# EAGLE design Adafruit ESP32 Feather V2 (EAGLE 9.6.2)
COMPANY: ADAFRUIT INDUSTRIES; DRAWN: ladyada; REV: E
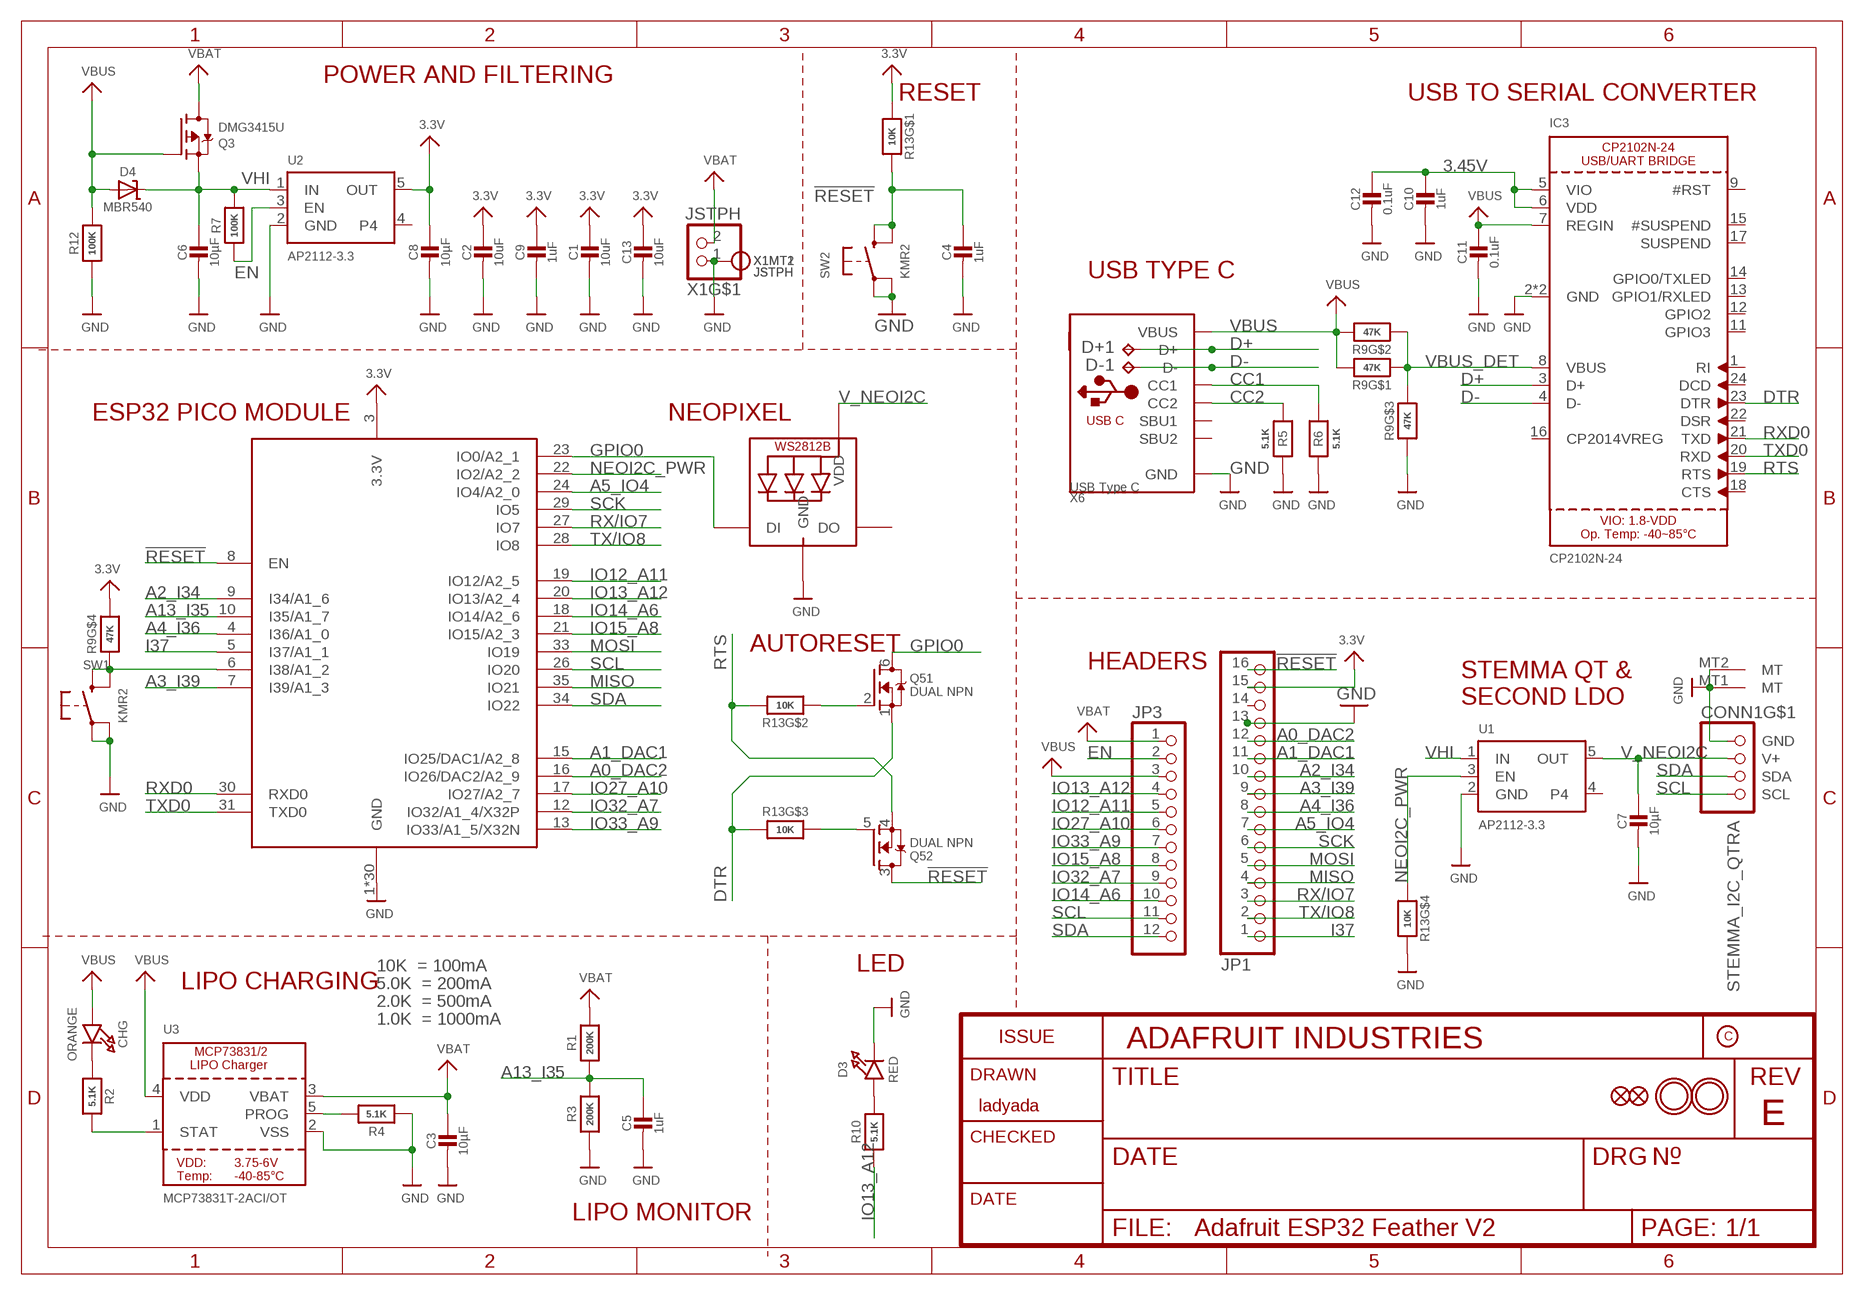
[diagram p0: schematic, sheet 1]

## Parts
C1  10uF  CAP_CERAMIC0805-NOOUTLINE  [0805-NO]
C2  10uF  CAP_CERAMIC0805-NOOUTLINE  [0805-NO]
C3  10µF  CAP_CERAMIC0805-NOOUTLINE  [0805-NO]
C4  1uF  CAP_CERAMIC0603_NO  [0603-NO]
C5  1uF  CAP_CERAMIC0603_NO  [0603-NO]
C6  10µF  CAP_CERAMIC0805-NOOUTLINE  [0805-NO]
C7  10µF  CAP_CERAMIC0805-NOOUTLINE  [0805-NO]
C8  10µF  CAP_CERAMIC0805-NOOUTLINE  [0805-NO]
C9  1uF  CAP_CERAMIC0603_NO  [0603-NO]
C10  1uF  CAP_CERAMIC0603_NO  [0603-NO]
C11  0.1uF  CAP_CERAMIC0603_NO  [0603-NO]
C12  0.1uF  CAP_CERAMIC0603_NO  [0603-NO]
C13  10uF  CAP_CERAMIC0805-NOOUTLINE  [0805-NO]
CHG  ORANGE  LED0603_NOOUTLINE  [CHIPLED_0603_NOOUTLINE]
CONN1  STEMMA_I2C_QTRA  [JST_SH4_RA]
D3  RED  LED0603_NOOUTLINE  [CHIPLED_0603_NOOUTLINE]
D4  MBR540  DIODE-SCHOTTKYSOD-123  [SOD-123]
D+1  TPB1,27  [B1,27]
D-1  TPB1,27  [B1,27]
IC3  CP2102N-24  [QFN24_4MM_SMSC]
JP1  HEADER-1X16ROUND  [1X16_ROUND]
JP3  HEADER-1X12  [1X12_ROUND]
LED1  WS2812B3535  [LED3535]
Q3  DMG3415U  MOSFET-P  [SOT23-R]
Q5  DUAL NPN  MOSFET-N_DUAL  [SOT363]
R1  200K  RESISTOR_0603_NOOUT  [0603-NO]
R2  5.1K  RESISTOR_0603_NOOUT  [0603-NO]
R3  200K  RESISTOR_0603_NOOUT  [0603-NO]
R4  5.1K  RESISTOR_0603_NOOUT  [0603-NO]
R5  5.1K  RESISTOR_0603_NOOUT  [0603-NO]
R6  5.1K  RESISTOR_0603_NOOUT  [0603-NO]
R7  100K  RESISTOR_0603_NOOUT  [0603-NO]
R9  47K  RESISTOR_4PACK  [RESPACK_4X0603]
R10  5.1K  RESISTOR_0603_NOOUT  [0603-NO]
R12  100K  RESISTOR_0603_NOOUT  [0603-NO]
R13  10K  RESISTOR_4PACK  [RESPACK_4X0603]
SW1  KMR2  SWITCH_TACT_SMT4.6X2.8  [BTN_KMR2_4.6X2.8]
SW2  KMR2  SWITCH_TACT_SMT4.6X2.8  [BTN_KMR2_4.6X2.8]
U1  AP2112-3.3  VREG_SOT23-5  [SOT23-5]
U2  AP2112-3.3  VREG_SOT23-5  [SOT23-5]
U3  MCP73831T-2ACI/OT  MCP73831/2  [SOT23-5]
U$31  MOUNTINGHOLE2.5  [MOUNTINGHOLE_2.5_PLATED]
U$32  MOUNTINGHOLE2.5  [MOUNTINGHOLE_2.5_PLATED]
U$34  FIDUCIAL_1MM  [FIDUCIAL_1MM]
U$35  FIDUCIAL_1MM  [FIDUCIAL_1MM]
X1  JSTPH  CON_JST_PH_2PIN_MT_BATT  [JSTPH2_BATT]
X3  ESP32-PICO-MINI-02MINI  [ESP32-PICO-MINI]
X6  USB Type C  USB_C  [USB_C_CUSB31-CFM2AX-01-X]

## Nets
3.3V [power]: C1.1 C2.1 C8.1 C9.1 C13.1 JP1.15 R9.5 R13.1 U2.5(OUT) X3.3(3.3V)
3.45V [power]: C10.1 C12.1 IC3.5(VIO) IC3.6(VDD)
!RESET: C4.1 JP1.16 Q5.3(2:D) R13.8 SW2.B'(S1) SW2.B(S) X3.8(EN)
A0_DAC2: JP1.12 X3.16(IO26/DAC2/A2_9)
A1_DAC1: JP1.11 X3.15(IO25/DAC1/A2_8)
A2_I34: JP1.10 X3.9(I34/A1_6)
A3_I39: JP1.9 X3.7(I39/A1_3)
A4_I36: JP1.8 X3.4(I36/A1_0)
A5_IO4: JP1.7 X3.24(IO4/A2_0)
A13_I35: C5.1 R1.1 R3.2 X3.10(I35/A1_7)
CC1: R6.2 X6.A5(CC1)
CC2: R5.2 X6.B5(CC2)
D+: D+1.TP IC3.3(D+) X6.A6(D+) X6.B6(D+)
D-: D-1.TP IC3.4(D-) X6.A7(D-) X6.B7(D-)
DTR: IC3.23(DTR) Q5.1(1:S) R13.3
EN: JP3.2 R7.1 U2.3(EN)
GND [power]: C1.2 C2.2 C3.2 C4.2 C5.2 C6.2 C7.2 C8.2 C9.2 C10.2 C11.2 C12.2 C13.2 CONN1.1(GND) CONN1.MT1(MT) CONN1.MT2(MT) D3.C IC3.2(GND) IC3.THERM(GND) JP1.13 LED1.4(GND) R3.1 R4.1 R5.1 R6.1 R9.3 R12.1 R13.5 SW1.A'(P1) SW1.A(P) SW2.A'(P1) SW2.A(P) U1.2(GND) U2.2(GND) U3.2(VSS) X1.1 X1.NC1 X1.NC2 X3.1(GND) X3.2(GND) X3.11(GND) X3.14(GND) X3.36(GND) X3.37(GND) X3.38(GND) X3.39(GND) X3.40(GND) X3.41(GND) X3.42(GND) X3.43(GND) X3.44(GND) X3.45(GND) X3.46(GND) X3.47(GND) X3.48(GND) X3.49(GND) X3.50(GND) X3.51(GND) X3.52(GND) X3.53(GND) X3.54(GND) X3.55(GND) X3.56(GND) X3.57(GND) X3.58(GND) X3.59(GND) X3.60(GND) X3.61(GND) X6.A1B12(GND) X6.B1A12(GND)
GPIO0: LED1.1(DI) Q5.6(1:D) X3.23(IO0/A2_1)
I37: JP1.1 X3.5(I37/A1_1)
IO12_A11: JP3.5 X3.19(IO12/A2_5)
IO13_A12: JP3.4 R10.1 X3.20(IO13/A2_4)
IO14_A6: JP3.10 X3.18(IO14/A2_6)
IO15_A8: JP3.8 X3.21(IO15/A2_3)
IO27_A10: JP3.6 X3.17(IO27/A2_7)
IO32_A7: JP3.9 X3.12(IO32/A1_4/X32P)
IO33_A9: JP3.7 X3.13(IO33/A1_5/X32N)
MISO: JP1.4 X3.35(IO21)
MOSI: JP1.5 X3.33(IO19)
N$1: CHG.C R2.1
N$3: R2.2 U3.1(STAT)
N$4: R4.2 U3.5(PROG)
N$5: D3.A R10.2
N$6: R9.4 SW1.B'(S1) SW1.B(S) X3.6(I38/A1_2)
N$12: Q5.5(2:G) R13.6
N$13: Q5.2(1:G) R13.2
NEOI2C_PWR: R13.4 U1.3(EN) X3.22(IO2/A2_2)
RTS: IC3.19(RTS) Q5.4(2:S) R13.7
RX/IO7: JP1.3 X3.27(IO7)
RXD0: IC3.21(TXD) X3.30(RXD0)
SCK: JP1.6 X3.29(IO5)
SCL: CONN1.4(SCL) JP3.11 X3.26(IO20)
SDA: CONN1.3(SDA) JP3.12 X3.34(IO22)
TX/IO8: JP1.2 X3.28(IO8)
TXD0: IC3.20(RXD) X3.31(TXD0)
V_NEOI2C [power]: C7.1 CONN1.2(V+) LED1.2(VDD) U1.5(OUT)
VBAT [power]: C3.1 JP3.1 Q3.3(D) R1.2 U3.3(VBAT) X1.2
VBUS [power]: C11.1 CHG.A D4.A IC3.7(REGIN) JP3.3 Q3.1(G) R9.7 R9.8 R12.2 U3.4(VDD) X6.A4B9(VBUS) X6.B4A9(VBUS)
VBUS_DET: IC3.8(VBUS) R9.1 R9.2 R9.6
VHI [power]: C6.1 D4.C Q3.2(S) R7.2 U1.1(IN) U2.1(IN)
Unconnected: IC3.1(RI) IC3.9(#RST) IC3.11(GPIO3) IC3.12(GPIO2) IC3.13(GPIO1/RXLED) IC3.14(GPIO0/TXLED) IC3.15(#SUSPEND) IC3.16(CP2014VREG) IC3.17(SUSPEND) IC3.18(CTS) IC3.22(DSR) IC3.24(DCD) JP1.14 LED1.3(DO) U1.4 U2.4 X6.A8(SBU1) X6.B8(SBU2)

## Notes on the sheet
- POWER AND FILTERING | RESET
- USB TO SERIAL CONVERTER
- USB TYPE C
- ESP32 PICO MODULE | NEOPIXEL
- AUTORESET
- HEADERS
- STEMMA QT &
  SECOND LDO
- 10K  = 100mA | LED
- LIPO CHARGING | 5.0K  = 200mA
- 2.0K  = 500mA
- 1.0K  = 1000mA
- LIPO MONITOR

## Library data of the parts
C1-C7 C9-C13 = microbuilder:CAP_CERAMIC: Ceramic Capacitors For new designs, use the packages preceded by an '_' character since they are more reliable: The following footprints should be used on most boards: _0402 - Standard footprint for regular board layouts _0603 - Standard footprint for regular board layouts _0805 - Standard footprint for regular board layouts _1206 - Standard footprint for regular board layouts For extremely tight-pitch boards where space is at a premium, the following 'micro-pitch' footprints can be used (smaller pads, no silkscreen outline, etc.): _0402MP - Micro-pitch footprint for very dense/compact boards _0603MP - Micro-pitch footprint for very dense/compact boards _0805MP - Micro-pitch footprint for very dense/compact boards _1206MP - Micro-pitch footprint for very dense/compact boards
C8 = microbuilder:CAP_CERAMIC: Ceramic Capacitors For new designs, use the packages preceded by an '_' character since they are more reliable: The following footprints should be used on most boards: _0402 - Standard footprint for regular board layouts _0603 - Standard footprint for regular board layouts _0805 - Standard footprint for regular board layouts _1206 - Standard footprint for regular board layouts For extremely tight-pitch boards where space is at a premium, the following 'micro-pitch' footprints can be used (smaller pads, no silkscreen outline, etc.): _0402MP - Micro-pitch footprint for very dense/compact boards _0603MP - Micro-pitch footprint for very dense/compact boards _0805MP - Micro-pitch footprint for very dense/compact boards _1206MP - Micro-pitch footprint for very dense/compact boards; REV: F
CHG D3 = microbuilder:LED: LED 0603 - 0603 Surface Mount Package 2mA: Green LED - Low Power (3.9mcd, 2ma, 1.7Vf) - Digikey: 475-2709-2-ND Orange LED - Low Power (9.8mcd, 2ma, 1.8Vf) - Digikey: 475-1194-2-ND Red LED - Low Power (5mcd, 2ma, 1.8Vf) - Digikey: 475-1195-2-ND Yellow LED - Low Power (7mcd, 2ma, 1.8Vf) - Digikey: 475-1196-2-ND 5mA: Blue LED - Low Power (17mcd, 5ma, 2.9Vf) - Digikey: LNJ937W8CRACT-ND 0805 - 0805 Surface Mount Package 2mA: Red LED (8.8mcd, 2mA, 1.8Vf, Clear) - Low Power [Digikey: 475-2510-1-ND] Green LED (5mcd, 2mA, 1.8Vf, Clear) - Low Power [Digikey: 475-2730-1-ND] Yellow LED (11.3mcd, 2mA, 1.8Vf, Clear) - Low Power [Digikey: 475-2555-1-ND] 20mA: Red LED (104mcd, 20mA, Diffused) - LS R976 [Digikey: 475-1278-6-ND] Red LED (12mcd, 20mA, 2.0Vf, Clear) - APT2012EC [Digikey: 754-1128-1-ND] Green LED (15mcd, 20mA, 2.2Vf, Clear) - APT2012GC [Digikey: 754-1131-1-ND] Orange LED (160mcd, 20mA, 2.1Vf, Clear) - APT2012SECK [Digikey: 754-1130-1-ND] 1206 - 1206 Surface Mount Package Green LED (26mcd, 20mA, Diffused) - LG N971 [Digikey: 475-1407-6-ND] Red LED (15mcd, 20mA, Diffused) - LH N974 [Digikey: 475-1416-6-ND] Cree - Cree High-Power Surface Mount LEDs XPEBWT-L1-0000-00D50 - White 111lm 350mA 2.9Vf 6200K 110° XTEAWT-00-0000-00000LEE3 - White 114lm 350mA 2.85Vf 5000K 115° Everlight - Everlight 45-21 Series Surface Mount LEDs 45-21/QK2C-B2832AC2CB2/2T - Warm White 2000mcd 20mA 3.25Vf 3050K 120° 45-21/LK2C-B38452C4CB2/2T - Nuetral White 2000mcd 20mA 3.25Vf 4150K 120° 45-21/LK2C-B50634C6CB2/2T - Cold White 2200mcd 20mA 3.25Vf 5650K 120° PLCC2 Reverse Mount LS T77K-J1L2-1-0-2-R18-Z - Red 11.25mcd 2mA 1.8Vf 630nm 120° LO T77K-L1M2-24-Z - Orange 19.6mcd 2mA 1.8Vf 606nm 120° LY T77K-K2M1-26-Z - Yellow 15.7mcd 2mA 1.8Vf 587nm 120°
CONN1 = microbuilder:STEMMA_I2C
D4 = microbuilder:DIODE-SCHOTTKY
D+1 D-1 = testpad:TP: Test pad
IC3 = microbuilder:CP2102N-24
JP1 = microbuilder:HEADER-1X16: PIN HEADER
JP3 = microbuilder:HEADER-1X12
LED1 = microbuilder:WS2812B
Q3 = microbuilder:MOSFET-P: P-Channel Mosfet LEGEND VDS: Voltage Drain-Source ID: Drain Current RDS(ON): Drain-Source On-State Resistance VGS(TH): Gate-Source Threshold Voltage CISS: Drain-Source Input Capacitance SOT-23 Name VDS ID RDS(ON) VGS(TH) CISS Order Number IRLML5103 30V 760mA 600 mOhm -- 75pF @ 25V Digikey: IRLML5103PBFCT-ND IRLML6401 12V 4.3A 50 mOhm 950mV @ 250µA 830pF @ 10V Digikey: IRLML6401PBFTR-ND NTR0202PL 20V 400mA 800 mOhm 2.3V @ 250uA 70pF @ 5V Digikey: NTR0202PLT1GOSTR-ND NTR4101PT1G 20V 1.8A 85 mOhm 1.2V @ 250uA 675pF @ 10V Digikey: NTR4101PT1GOSCT-ND DMP2004K 20V 600mA 900 mOhm 1V @ 250uA 175pF @ 16V Digikey: DMP2004KDICT-ND PMV65XP 20V 3.9A 76 mOhm 950mV @ 1mA 725pF @ 20V Digikey: 568-2358-2-ND TO-252 Name VDS ID RDS(ON) VGS(TH) CISS Order Number AOD417 30V 25A 34 mOhm 3V @ 250µA 920pF @ 15V Digikey: 785-1106-2-ND PowerPak Name VDS ID RDS(ON) VGS(TH) CISS Order Number AON7401 30V 12A 14 mOhm 3V @ 250µA 2600pF @ 15V Digikey: 785-1302-1-ND
Q5 = microbuilder:MOSFET-N_DUAL: Dual N-Channel MOSFET SOT363 (2.0x1.25mm) 2N7002PS - 60V, 320mA [Digikey: 568-5984-1-ND]
R1-R7 R10 R12 = microbuilder:RESISTOR: Resistors For new designs, use the packages preceded by an '_' character since they are more reliable: The following footprints should be used on most boards: _0402 - Standard footprint for regular board layouts _0603 - Standard footprint for regular board layouts _0805 - Standard footprint for regular board layouts _1206 - Standard footprint for regular board layouts For extremely tight-pitch boards where space is at a premium, the following 'micro-pitch' footprints can be used (smaller pads, no silkscreen outline, etc.): _0402MP - Micro-pitch footprint for very dense/compact boards _0603MP - Micro-pitch footprint for very dense/compact boards _0805MP - Micro-pitch footprint for very dense/compact boards _1206MP - Micro-pitch footprint for very dense/compact boards
R9 R13 = microbuilder:RESISTOR_4PACK: Resistor Packs (4 resistors) 4 x 0603 10K 1/16W - Digikey: YC164J-10KCT-ND
SW1 SW2 = adafruit_electromech:SWITCH_TACT_SMT: SMT Tact Switches 6x6mm - Digikey: P12940SCT-ND KMR2 (4.6x2.8mm) - Digikey: 401-1426-1-ND EVQ-PQHB55 - Light Touch, 160GF (4.5x4.5mm) - Digikey: P8090SCT-ND KMT0 - KMT021 NGJ LHS (etc.) IP68/Waterproof - Digikey: CKN10289CT-ND
U1 U2 = adafruit_power:VREG_SOT23-5: SOT23-5 Fixed Voltage Regulators Part Current Out V Out V In V Dropout θJA (°C/W) TJ (°C) Digikey Part No. ADP121 150mA 3.3V 3.4-5.5V 0.09V @ 150mA -- -- ADP121-AUJZ33R7CT-ND ADP121 150mA 3.0V 3.1-5.5V 0.09V @ 150mA -- -- ADP121-AUJZ30R7CT-ND ADP122 300mA 3.3V 3.4-5.5V 0.085V @ 300mA -- -- ADP122AUJZ-3.3-R7CT-ND ADP1712 300mA 3.3V 3.5-5.5V 0.17V @ 300mA -- -- ADP1712AUJZ-3.3-R7TR-ND AP7311 (Low Cost) 150mA 3.3V 3.5-6V 0.15V @ 150mA -- -- AP7311-33WG-7DICT-ND LD39015M18R 150mA 1.8V 1.9V-5.5V 0.08V @ 100mA -- -- 497-6977-1-ND LP2985A-33DBVR 150mA 3.3V 3.3-16V 0.28V @ 150mA 206 150 296-18479-1-ND MCP1824T-3302E/OT 300mA 3.3V 3.5V-6V 0.2V @ 300mA -- -- MCP1824T-3302E/OTCT-ND MIC5205-2.5YM5 TR 150mA 2.5V 2.7-16V 0.165V @ 150mA -- -- 576-1257-2-ND MIC5205-3.0YM5 TR 150mA 3.0V 3.2V-16V 0.165V @ 150mA -- -- 576-1258-2-ND MIC5205-3.3YM5 TR 150mA 3.3V 3.5V-16V 0.165V @ 150mA -- -- 576-1259-2-ND TPS780330220 150mA 3.3V+2.2V 3.6-5.5V 250mV Max -- -- 296-23332-1-ND TDA3663/N1,135 100mA 3.3V 3.5-45V 0.18V @ 50mA -- -- 568-5343-1-ND Max operating temp can be calculated using θJA, TJ (max junction temperature), and power in watts. Set the "Maximum Ambient Temperature" until it reaches TJ ("Max Junction Temperature"), which is the absolute limit for safe use of the regulator: Heat Sink Temperature Calculator <http://www.daycounter.com/Calculators/Heat-Sink-Temperature-Calculator.phtml> For example, With 12V source into a 3.3V LP2985 and a 30mA load, we are dissipating (12V-3.3V) * 0.03A = 0.261W. With a θJA of 206 °C/W, a TJ of 150°C, and 261mW we can safely use the chip without a heat sink up to 75°C (=147.1°C Junction Temperature).
U3 = microbuilder:MCP73831/2: MCP73831/2 LIPO Charger VDD: 3.75 - 6V Temp -40 - 85°C Programmable Charge Rate: 15-500mA NOTE: STAT is a tri-state logic output on the MCP73831 and an open-drain output on the MCP73832. SOT23-5 with 4.2V output and tri-state logic on STAT = MCP73831T-2ACI/OT
U$31 U$32 = adafruit_electromech:MOUNTINGHOLE: Mounting Hole For #2 screws (0.086"/2.18mm width, 0.094"/2.4mm hole) use 2.5mm; BOM: EXCLUDE
U$34 U$35 = microbuilder:FIDUCIAL: Fiducial Alignment Points Various fiducial points for machine vision alignment.; BOM: EXCLUDE
X1 = adafruit_electromech:CON_JST_PH_2PIN_MT
X3 = adafruit_wireless:ESP32-PICO-MINI-02
X6 = adafruit_electromech:USB_C: USB Type-C USB 2.0 Connector

## Net classes
1 power: width 0.305 mm

## Board
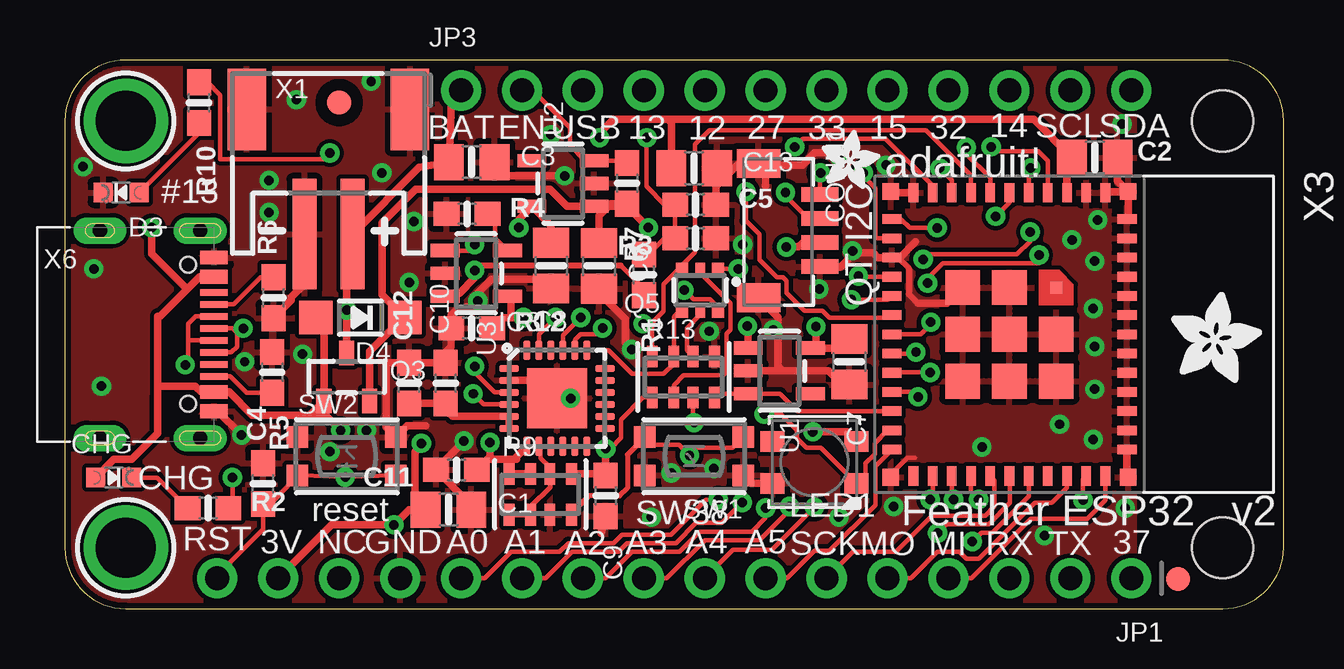
[diagram p1: board, top side]
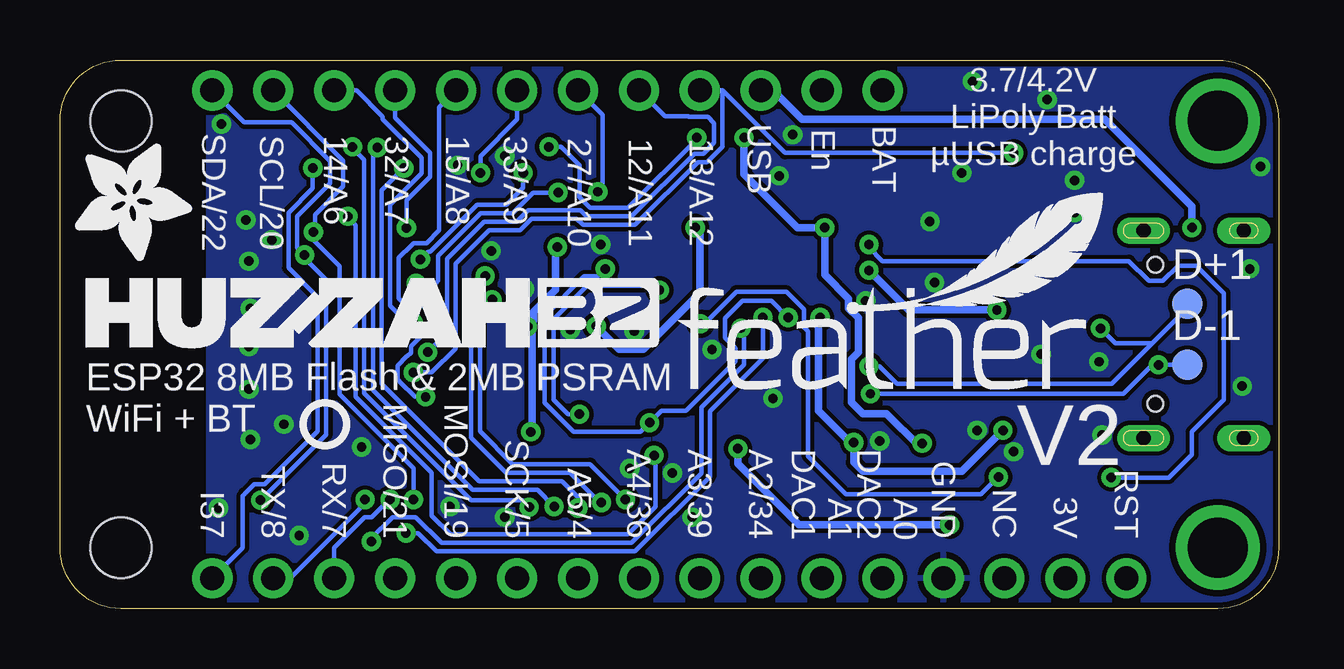
[diagram p2: board, bottom side, seen from below]

Size 50.8 x 22.86 mm. Coordinates in mm from the lower left corner, seen from the top.
Outline: 2.54,0 48.26,0 arc90 50.8,2.54 50.8,20.32 arc90 48.26,22.86 2.54,22.86 arc90 0,20.32 0,2.54 arc90 2.54,0
Copper layers (1*16): Top 0.035mm / dielectric 1.5mm / Bottom 0.035mm
Design rules "adafruit 7-7": minimum track width 7mil, minimum drill 15.5mil, track to track 7mil, track to pad 7mil, pad to pad 7mil, via to via 7mil, smd to smd 7mil, copper to edge 10mil, drill to drill 8mil, minimum pad ring 10mil, minimum via ring 8mil, stop-mask expansion 2mil, vias tented up to drill 20mil, thermal gap 10mil
Holes 2.54 mm at 48.26,2.54 48.26,20.32

### Footprints (pad centres in the part's own frame; a part is rotated, then mirrored left to right if it is on the bottom)
0805-NO = smd 1.24 x 1.5: 1 -0.95,0; 2 0.95,0
0603-NO = smd 1.075 x 1: 1 -0.85,0; 2 0.85,0
CHIPLED_0603_NOOUTLINE = smd 0.8 x 0.8: A 0,-0.75; C 0,0.75
JST_SH4_RA = smd 0.6 x 1.55: 1 1.5,1.686; 2 0.5,1.686; 3 -0.5,1.686; 4 -1.5,1.686 | smd 1.2 x 1.8: MT1 -2.8,-0.862; MT2 2.8,-0.862
SOD-123 = smd 1.4 x 1.4: A 1.85,0; C -1.85,0
B1,27 = smd 1.27 x 1.27: TP 0,0
QFN24_4MM_SMSC = smd 0.8 x 0.28: 1 -2,1.25; 2 -2,0.75; 3 -2,0.25; 4 -2,-0.25; 5 -2,-0.75; 6 -2,-1.25; 13 2,-1.25; 14 2,-0.75; 15 2,-0.25; 16 2,0.25; 17 2,0.75; 18 2,1.25 | smd 0.28 x 0.8: 7 -1.25,-2; 8 -0.75,-2; 9 -0.25,-2; 10 0.25,-2; 11 0.75,-2; 12 1.25,-2; 19 1.25,2; 20 0.75,2; 21 0.25,2; 22 -0.25,2; 23 -0.75,2; 24 -1.25,2 | smd 2.5 x 2.5: THERM 0,0
1X16_ROUND = drill 1 pad 1.676: 1 -19.05,0; 2 -16.51,0; 3 -13.97,0; 4 -11.43,0; 5 -8.89,0; 6 -6.35,0; 7 -3.81,0; 8 -1.27,0; 9 1.27,0; 10 3.81,0; 11 6.35,0; 12 8.89,0; 13 11.43,0; 14 13.97,0; 15 16.51,0; 16 19.05,0
1X12_ROUND = drill 1 pad 1.676: 1 -13.97,0; 2 -11.43,0; 3 -8.89,0; 4 -6.35,0; 5 -3.81,0; 6 -1.27,0; 7 1.27,0; 8 3.81,0; 9 6.35,0; 10 8.89,0; 11 11.43,0; 12 13.97,0
LED3535 = smd 1 x 0.85: 1 -1.75,0.875; 2 -1.75,-0.875; 3 1.75,-0.875; 4 1.75,0.875
SOT23-R = smd 0.635 x 1.016: 1 -0.95,-1; 2 0.95,-1; 3 0,1
SOT363 = smd 0.5 x 0.5: 1 -0.75,-0.9; 3 0.75,-0.9; 4 0.75,0.9; 6 -0.75,0.9 | smd 0.4 x 0.5: 2 0,-0.9; 5 0,0.9
RESPACK_4X0603 = smd 0.45 x 0.9: 1 -1.3,-0.85; 2 -0.4,-0.85; 3 0.4,-0.85; 4 1.3,-0.85; 5 1.3,0.85; 6 0.4,0.85; 7 -0.4,0.85; 8 -1.3,0.85
BTN_KMR2_4.6X2.8 = smd 0.9 x 0.9: A 2.05,0.8; A' -2.05,0.8; B 2.05,-0.8; B' -2.05,-0.8
SOT23-5 = smd 0.55 x 1.2: 1 -0.95,-1.3; 2 0,-1.3; 3 0.95,-1.3; 4 0.95,1.3; 5 -0.95,1.3
MOUNTINGHOLE_2.5_PLATED = drill 2.5 pad 3.2: P$1 0,0
FIDUCIAL_1MM = smd 1 x 1: 1 0,0
JSTPH2_BATT = smd 1 x 4.6: 1 -1,-3.7; 2 1,-3.7 | smd 1.6 x 3.4: NC1 -3.4,1.5; NC2 3.4,1.5
ESP32-PICO-MINI = smd 0.8 x 0.4: 1 -5.9,4; 2 -5.9,3.2; 3 -5.9,2.4; 4 -5.9,1.6; 5 -5.9,0.8; 6 -5.9,0; 7 -5.9,-0.8; 8 -5.9,-1.6; 9 -5.9,-2.4; 10 -5.9,-3.2; 11 -5.9,-4; 25 5.9,-4; 26 5.9,-3.2; 27 5.9,-2.4; 28 5.9,-1.6; 29 5.9,-0.8; 30 5.9,0; 31 5.9,0.8; 32 5.9,1.6; 33 5.9,2.4; 34 5.9,3.2; 35 5.9,4 | smd 0.4 x 0.8: 12 -4.8,-4.9; 13 -4,-4.9; 14 -3.2,-4.9; 15 -2.4,-4.9; 16 -1.6,-4.9; 17 -0.8,-4.9; 18 0,-4.9; 19 0.8,-4.9; 20 1.6,-4.9; 21 2.4,-4.9; 22 3.2,-4.9; 23 4,-4.9; 24 4.8,-4.9; 36 4.8,4.9; 37 4,4.9; 38 3.2,4.9; 39 2.4,4.9; 40 1.6,4.9; 41 0.8,4.9; 42 0,4.9; 43 -0.8,4.9; 44 -1.6,4.9; 45 -2.4,4.9; 46 -3.2,4.9; 47 -4,4.9; 48 -4.8,4.9 | smd 1.45 x 1.45: 49 0,0; 54 -1.95,0; 55 -1.95,-1.95; 56 0,-1.95; 57 1.95,-1.95; 58 1.95,0; 59 1.95,1.95; 60 0,1.95 | smd 0.7 x 0.7: 50 5.95,4.95; 51 5.95,-4.95; 52 -5.95,-4.95; 53 -5.95,4.95 | smd 0.5 x 0.5: 61 -1.95,1.95
USB_C_CUSB31-CFM2AX-01-X = smd 0.575 x 1.15: A1B12 -3.2,3.545; A4B9 -2.4,3.545; B1A12 3.2,3.545; B4A9 2.4,3.545 | smd 0.275 x 1.15: A5 -1.25,3.545; A6 -0.25,3.545; A7 0.25,3.545; A8 1.25,3.545; B5 1.75,3.545; B6 0.75,3.545; B7 -0.75,3.545; B8 -1.75,3.545 | drill 0.6 pad 1 long: M1 -4.32,2.97; M2 4.32,2.97; M3 -4.32,-1.21; M4 4.32,-1.21 | hole 0.65: 2.89,2.47; -2.89,2.47

### Placement (x,y rotation side)
C1  15.99,4.13 0 top
C2  42.93,18.8 0 top
C3  16.95,18.61 0 top
C4  8.26,5.21 90 top
C5  26.29,16.83 0 top
C6  22.27,14.28 270 top
C7  32.7,10.29 270 top
C8  20.27,14.29 270 top
C9  22.54,4.7 270 top
C10  15.88,9.4 90 top
C11  16.32,5.78 180 top
C12  14.35,9.4 90 top
C13  26.23,18.35 0 top
CHG  2.03,5.46 270 top
CONN1  29.78,15.75 270 top
D3  2.35,17.34 90 top
D4  12.32,12.13 180 top
D+1  3.81,12.7 0 bottom
D-1  3.81,10.16 0 bottom
IC3  20.51,8.76 0 top
JP1  25.4,1.27 180 top
JP3  30.48,21.59 0 top
LED1  31.24,6.1 180 top
Q3  11.75,9.65 0 top
Q5  26.48,13.27 180 top
R1  24.13,13.91 270 top
R2  5.97,4.19 0 top
R3  26.29,15.43 180 top
R4  16.76,16.45 0 top
R5  8.64,9.84 270 top
R6  8.7,12.95 90 top
R7  23.43,17.72 270 top
R9  19.81,4.76 0 top
R10  5.59,21.08 270 top
R12  16.95,11.68 0 top
R13  25.78,9.65 0 top
SW1  26.23,6.35 180 top
SW2  11.75,6.35 0 top
U1  29.78,9.91 270 top
U2  20.76,17.72 90 top
U3  17.14,13.97 270 top
U$7  [ADAFRUIT_5MM]  50.16,19.37 270 bottom
U$9  [FEATHERLOGO_MED]  25.15,9.08 0 bottom
U$13  [PCBFEAT-REV-040]  39.75,7.68 0 bottom
U$14  [ADAFRUIT_2.5MM]  31.55,17.5 0 top
U$15  [ADAFRUIT_3.5MM]  46.1,9.4 0 top
U$31  2.54,20.32 270 top
U$32  2.54,2.54 270 top
U$34  11.43,21.08 270 top
U$35  46.4,1.24 270 top
U$43  [HUZZAH32]  49.72,10.86 0 bottom
X1  10.99,19.3 0 top
X3  39.37,11.43 270 top
X6  2.67,11.43 270 top

### Tracks (layer width: path | path; a pad name or v marks a point on that pad's centre or on a via)
3.3V  (via drill 0.39)
  Top 0.178: R13.1 24.1,8.8 23.18,7.88 23.18,7.11 22.73,6.67 v22.54,6.67
  Top 0.305: JP1.15 11.11,3.49 v13.72,3.49 14.35,4.13 C1.1 14.6,4.57 14.6,6.53 14.91,6.84 v14.86,6.89 | C8.1 20.27,15.96 U2.5 18.92,16.23 v18.92,15.88 | X3.3 41.77,18.59 C2.1 40.39,20.38 25.15,20.38 | 25.15,20.38 22.86,20.38 22.29,19.81 v22.29,19.62 | 25.15,20.38 25.28,20.25 C13.1 | R9.5 22.48,5.61 C9.1 v22.54,6.67
  Bottom 0.305: v14.86,6.89 14.99,6.76 16.35,8.13 17.34,8.13 17.81,8.6 17.81,10.4 17.53,10.69 17.53,12.11 17.94,12.53 17.94,12.92 18.92,13.91 v18.92,15.88 20.07,15.88 22.29,18.1 v22.29,19.62 | v22.54,6.67 22.54,6.03 20,3.49 v13.72,3.49
3.45V
  Top 0.305: IC3.6 IC3.5 16.16,8.01 16.02,8.15 16.02,8.4 C10.1 C12.1
!RESET  (via drill 0.39)
  Top 0.178: X3.8 37.77,18.05 35.88,19.94 26.86,19.94 26.27,19.35 26.27,14.84 25.73,14.3 Q5.3 25.6,14.17 24.96,13.53 24.96,12.38 24.54,11.97 24.5,11.97 | SW2.B v11.68,5.49 SW2.B' 8.57,4.36 C4.1 8.26,3.3 6.35,1.4 JP1.16 | 24.5,11.97 24.48,11.94 R13.8 | v24.1,11.87 24.13,11.84 24.26,11.97 24.5,11.97
  Bottom 0.178: v11.68,5.49 12.41,4.76 18.03,4.76 19.62,6.35 19.62,11.57 19.78,11.72 19.78,12.47 20.52,13.21 22.61,13.21 24.02,11.79 v24.1,11.87
A0_DAC2  (via drill 0.39)
  Top 0.178: X3.16 34.31,12.87 v32.78,12.87 | v27.23,4.55 26.72,4.55 25.26,3.09 23.23,3.09 22.87,2.73 20.98,2.73 20.62,2.37 19.52,2.37 19.51,2.38 18.59,2.38 17.49,1.27 JP1.12
  Bottom 0.178: v32.78,12.87 33.3,12.36 33.3,7.39 31.93,6.02 28.7,6.02 v27.23,4.55
A1_DAC1  (via drill 0.39)
  Top 0.178: X3.15 33.11,13.83 v33.08,13.86 | v28.23,4.42 27.38,3.57 26.31,3.57 25.47,2.73 23.44,2.73 23.08,2.38 21.13,2.38 20.03,1.27 JP1.11
  Bottom 0.178: v28.23,4.42 28.3,4.42 29.54,5.66 32.21,5.66 33.66,7.12 33.66,13.28 v33.08,13.86
A2_I34  (via drill 0.39)
  Top 0.178: JP1.10 22.54,1.27 23.65,2.38 25.62,2.38 26.45,3.21 28.64,3.21 29.21,3.79 v29.21,4.19 | v36.47,18.35 36.97,17.85 X3.9
  Bottom 0.178: v29.21,4.19 29.21,4.64 29.88,5.31 33.32,5.31 37.39,9.38 37.39,17.42 v36.47,18.35
A3_I39  (via drill 0.39)
  Top 0.178: X3.7 38.57,17.95 37.57,18.94 v37.57,19.21 | v30.2,4.25 30.2,4.1 28.96,2.86 26.67,2.86 25.08,1.27 JP1.9
  Bottom 0.178: v37.57,19.21 37.57,19.15 37.75,18.97 37.75,9.11 33.6,4.95 30.9,4.95 v30.2,4.25
A4_I36  (via drill 0.39)
  Top 0.178: X3.4 40.97,18.66 40.58,19.05 38.8,19.05 v38.61,19.24 | v31.24,4.23 29.46,2.45 27.85,2.45 JP1.8
  Bottom 0.178: v38.61,19.24 38.61,19.18 38.12,18.69 38.12,8.98 33.66,4.51 31.52,4.51 v31.24,4.23
A5_IO4
  Top 0.178: X3.24 33.78,5.94 33.78,4.32 31.88,2.41 31.24,2.41 30.1,1.27 JP1.7
A13_I35  (via drill 0.39)
  Top 0.178: X3.10 36.17,17.61 34.2,19.58 30.76,19.58 v30.42,19.24 | R1.1 24.32,14.76 24.99,15.43 R3.2 C5.1 24.99,16.83 24.23,17.59 24.23,19.6 v24.26,19.62
  Bottom 0.178: v24.26,19.62 24.26,19.56 27.12,16.7 28.7,16.7 29.15,17.14 29.15,18.48 29.91,19.24 v30.42,19.24
CC1
  Top 0.178: X6.A5 7.03,12.68 8.15,13.8 R6.2
CC2
  Top 0.178: X6.B5 6.89,9.68 7.58,8.99 R5.2
D+  (via drill 0.39)
  Top 0.178: IC3.3 17.91,9.01 17.08,9.84 v17.08,10.1 | X6.B6 6.93,10.68 7.18,10.92 7.18,11.49 6.99,11.68 | 6.99,11.68 X6.A6 | 6.99,11.68 v7.43,11.68
  Bottom 0.178: v17.08,10.1 16.64,10.1 15.91,9.37 6.95,9.37 5.27,11.05 | D+1.TP 3.94,12.38 5.27,11.05 | v7.43,11.68 6.8,11.05 5.27,11.05
D-  (via drill 0.39)
  Top 0.178: IC3.4 17.46,8.51 v17.02,8.95 | X6.B7 5.45,12.18 5.14,11.87 5.14,11.24 | 5.14,11.24 5.21,11.18 X6.A7 | 5.14,11.24 5.14,10.29 v5.02,10.16
  Bottom 0.178: v17.02,8.95 6.48,8.95 5.27,10.16 v5.02,10.16 D-1.TP
DTR  (via drill 0.39)
  Top 0.178: IC3.23 19.76,11.44 v20.45,12.13 | v26.23,7.75 26.18,7.79 R13.3 | v28.07,14.16 27.3,14.16 27.26,14.2 Q5.1
  Bottom 0.178: v20.45,12.13 21.14,12.83 22.35,12.83 23.08,12.1 23.08,11.28 22.64,10.84 22.64,10.31 24.7,8.26 25.72,8.26 v26.23,7.75 26.61,7.37 29.4,7.37 30.61,8.57 30.61,12.19 28.96,13.84 28.38,13.84 v28.07,14.16
EN
  Top 0.178: R7.1 23.33,18.67 U2.3 21.68,18.67 21.05,19.3 21.05,20.04 19.49,21.59 JP3.2
GND  (via drill 0.39)
  Top 0.178: X3.51 34.42,5.59 35.12,6.29 35.43,6.29
  Top 0.254: 35.56,12.72 35.18,13.11 35.18,14.17 34.72,14.63 X3.14
  Top 0.305: C3.2 18.48,18.03 v20.83,18.03 | C8.2 19.9,13.72 17.78,13.72 17.14,13.08 17.14,12.57 16.74,12.57 16.58,12.41 16.29,12.41 16.11,12.23 R12.1 16.11,10.92 15.43,10.25 C12.2 | C12.2 C10.2 | IC3.2 19.76,9.51 IC3.THERM | U1.2 29.91,9.91 | 29.91,9.91 31.82,9.91 32.38,9.34 C7.2 | X6.B1A12 6.38,8.23 v7.37,7.24 | C1.2 16.94,4.31 C11.2 15.47,5.82 v16.64,6.99 | CONN1.1 31.49,14.22 32.32,14.22 32.92,14.82 33.69,14.82 33.88,14.63 X3.14 34.8,14.63 35.45,15.28 | X3.11 34.47,17.33 X3.52 | X3.53 43.88,17.82 C2.2 | X3.1 43.42,17.38 X3.53 | CONN1.MT1 28.1,18.55 27.14,17.59 C5.2 | CONN1.MT2 29.72,12.15 29.72,10.1 29.91,9.91 | SW1.A' 28.61,5.22 LED1.4 | CONN1.MT1 28.99,18.48 30.73,18.48 31.24,18.99 32.13,18.99 v32.26,18.86 | C12.2 13.4,10.25 13.4,7.55 SW2.A 14.27,7.62 15.04,7.62 | R6.1 9.44,12.84 9.44,12.96 9.99,13.51 X1.1 | X3.55 36.77,12.72 35.56,12.72 | CONN1.MT1 29.21,18.26 29.21,17.59 | C9.2 22.35,3.15 | C6.2 22.27,13.17 23.37,12.06 23.37,11.05 v23.62,10.79 | X3.50 44.27,5.53 X3.36 | X3.53 44.32,16.28 X3.48
  other vias: 26.86,11.56 9.65,21.21 12.76,21.97 8.51,17.84 8.51,16.51 13.21,18.16 0.76,18.41 1.21,14.16 1.52,9.27 7.49,10.29 9.91,10.6 21.08,8.76 27.05,5.84 24.45,3.81 11.05,6.54 14.54,16.13 14.35,13.59 17.21,12.83 34.23,18.48 29.53,11.62 20.26,19.75 34.54,4.25 38.23,6.73 41.47,7.68 42.86,7.05 42.93,9.14 42.93,10.92 42.86,12.51 42.93,14.48 41.97,15.37 43.05,16.19 44.2,4.19 40.83,3.05 32.83,14.91 25.27,5.65 28.26,15.18 31.43,13.32 32.26,3.81 12.57,7.43 44.07,20.19
  pour Top: 0,22.86 0,0 44.58,0 44.58,22.86
  pour Bottom: 0,0 44.58,0 44.58,22.86 0,22.86
GPIO0  (via drill 0.39)
  Top 0.178: v29.15,8.1 29.84,8.1 30.51,7.44 30.51,7.09 30.9,6.7 31.51,6.7 LED1.1 33.37,5.6 33.37,6.05 33.76,6.44 33.76,6.9 34.29,7.43 X3.23 | Q5.6 27.23,12.55 26.89,12.89 26.19,12.89 v25.81,13.27
  Bottom 0.178: v25.81,13.27 26,13.46 28.83,13.46 30.23,12.06 30.23,8.7 29.63,8.1 v29.15,8.1
I37  (via drill 0.39)
  Top 0.178: X3.5 40.17,18.27 v40.26,18.36
  Bottom 0.178: JP1.1 43.18,2.54 43.18,4.7 43.1,4.78 43.1,4.79 42.71,5.18 42.27,5.18 40.06,7.4 40.06,12.98 41.27,14.2 41.27,16.5 40.26,17.51 v40.26,18.36
IO12_A11  (via drill 0.39)
  Top 0.178: v35.47,10.69 35.41,10.63 X3.19
  Bottom 0.178: v35.47,10.69 34.67,11.49 34.67,14.57 33.12,16.12 31.77,16.12 31.28,16.61 29.11,16.61 28.85,16.34 26.97,16.34 24.36,18.95 23.98,18.95 23.53,19.4 23.53,20.23 23.79,20.48 24.59,20.48 24.61,20.51 25.59,20.51 JP3.5
IO13_A12  (via drill 0.39)
  Top 0.178: v36.07,9.84 34.48,9.84 X3.20 | R10.1 5.94,21.93 6.48,21.4 6.48,18.73 10.79,18.73 v11.05,18.99
  Bottom 0.178: v11.05,18.99 20.57,18.99 23.18,21.59 | v36.07,9.84 35.31,9.84 34.31,10.83 34.31,14.37 32.91,15.77 31.62,15.77 31.13,16.25 29.26,16.25 29,15.99 26.82,15.99 24.21,18.6 23.83,18.6 23.18,19.25 23.18,21.59 | 23.18,21.59 JP3.4
IO14_A6  (via drill 0.39)
  Top 0.178: v36.09,11.94 36.09,11.85 35.68,11.43 X3.18
  Bottom 0.178: v36.09,11.94 36.37,11.94 37.04,12.61 37.04,16.84 35.74,18.14 35.74,18.78 37.35,20.39 37.35,20.5 38.44,21.59 JP3.10
IO15_A8  (via drill 0.39)
  Top 0.178: X3.21 35.36,9.03 v35.56,8.83
  Bottom 0.178: JP3.8 34.99,20.89 34.99,15.76 35.53,15.22 36.06,15.22 36.13,15.15 36.15,15.15 36.68,14.61 36.68,12.92 36.37,12.61 35.67,12.61 35.38,12.32 35.38,11.51 35.53,11.35 35.75,11.35 36.16,10.94 36.16,10.67 36.32,10.51 36.34,10.51 36.73,10.12 36.73,9.57 36.64,9.47 36.64,9.46 36.01,8.83 v35.56,8.83
IO27_A10  (via drill 0.39)
  Top 0.178: X3.17 34.37,12.13 31.87,12.13 31.58,12.41 30.83,12.41 30.09,13.16 30.09,13.66 29.93,13.81 29.68,13.81 28.96,14.54 28.96,15.59 28.38,16.16 v28.38,17.37
  Bottom 0.178: v28.38,17.37 28.19,17.56 28.19,20.57 JP3.6
IO32_A7  (via drill 0.39)
  Top 0.178: v36.36,15.87 35.22,15.87 34.88,16.2 34.49,16.2 X3.12
  Bottom 0.178: v36.36,15.87 36.36,17.01 35.38,17.99 35.38,19 36.83,20.45 JP3.9
IO33_A9  (via drill 0.39)
  Top 0.178: X3.13 33.78,15.43 33.78,17.53 33.27,18.03 v33.27,18.16
  Bottom 0.178: JP3.7 31.75,20.38 33.27,18.86 v33.27,18.16
MISO
  Top 0.178: X3.35 43.37,4.51 42.61,3.75 40.26,3.75 37.78,1.27 JP1.4
MOSI
  Top 0.178: X3.33 41.77,5.04 41.15,4.42 40.43,4.42 38.09,2.08 37.58,2.08 37.29,2.38 36.37,2.38 35.27,1.27 JP1.5
N$1
  Top 0.178: CHG.C 3.85,5.46 R2.1
N$3  (via drill 0.39)
  Top 0.178: v17.08,15.18 16.82,14.92 U3.1 | v6.99,5.46 6.99,4.36 R2.2
  Bottom 0.178: v17.08,15.18 17.08,15.05 16.51,14.48 6.24,14.48 5.41,13.65 4.83,13.65 4.19,14.29 3.43,14.29 2.29,13.14 2.29,8.7 3.62,7.37 3.62,6.41 4.57,5.46 v6.99,5.46
N$4
  Top 0.178: U3.5 17.93,15.43 17.93,16.32 17.8,16.45 R4.2
N$5
  Top 0.178: R10.2 5.59,19.82 D3.A
N$6  (via drill 0.39)
  Top 0.178: SW1.B 24.49,6.83 25.59,6.83 v26.04,6.39 25.84,6.58 25.97,6.71 27.83,6.71 SW1.B' | X3.6 39.37,16.92 v38.8,16.34
  Top 0.203: SW1.B 23.45,6.42 23.45,5.02 23.12,4.7 21.84,4.7 21.11,3.97 R9.4
  Bottom 0.178: v26.04,6.39 25.97,6.32 25.97,4.25 27.13,3.09 34.52,3.09 35.31,3.87 35.31,5.66 38.48,8.83 38.48,15.98 38.8,16.29 v38.8,16.34
N$12
  Top 0.178: R13.6 25.93,10.76 25.93,11.69 26.48,12.24 Q5.5
N$13
  Top 0.178: R13.2 25.38,9.32 25.78,9.72 27.43,9.72 27.61,9.9 27.57,9.94 27.57,11.44 27.75,11.62 27.75,12.73 26.48,14 Q5.2
NEOI2C_PWR
  Top 0.178: X3.22 30.54,8.23 29.82,8.96 U1.3 27.23,8.96 R13.4
RTS
  Top 0.178: Q5.4 25.6,12.37 25.38,12.15 R13.7 25.38,10.2 24.96,9.78 23.63,9.78 22.65,10.76 IC3.19
RX/IO7  (via drill 0.39)
  Top 0.178: X3.27 36.97,4.62 v37.04,4.55
  Bottom 0.178: v37.04,4.55 37.08,4.55 37.81,3.82 38.09,3.82 39.37,2.54 JP1.3
RXD0  (via drill 0.39)
  Top 0.178: X3.30 39.4,5.5 39.4,4.41 38.51,3.52 36.75,3.52 v36.38,3.15 | v21.5,12.13 20.76,11.39 IC3.21
  Bottom 0.178: v36.38,3.15 35.88,3.15 35.11,2.38 26.83,2.38 23.71,5.5 23.71,8.23 21.5,10.44 v21.5,12.13
SCK
  Top 0.178: X3.29 38.75,5.35 38.75,4.27 38.36,3.88 36.14,3.88 34.63,2.38 32.85,2.38 JP1.6
SCL  (via drill 0.39)
  Top 0.178: X3.26 36.17,4.65 v36.06,4.55 | CONN1.4 31.47,18.13 v31.5,18.16 | v40.23,15.7 40.23,15.32 39.67,14.76 35.98,14.76 v35.78,14.55
  Bottom 0.178: v36.06,4.55 36.06,5.84 39.15,8.93 39.15,14.26 40.23,15.34 v40.23,15.7 40.17,15.76 40.17,16.41 38.99,17.59 38.99,18.67 JP3.11 | v31.5,18.16 31.5,17.53 32.19,16.83 33.41,16.83 35.38,14.87 35.47,14.87 v35.78,14.55
SDA  (via drill 0.39)
  Top 0.178: v42.44,4.52 42.44,5.4 X3.34 | CONN1.3 31,16.25 30.04,17.21 v30.04,17.34 | v40.61,14.73 40.61,14.39 36.59,14.39 36.1,13.9 36.1,13.71 v35.96,13.56
  Bottom 0.178: JP3.12 43.12,20.26 41.15,20.26 39.53,18.64 39.53,17.73 40.91,16.35 40.91,15.04 v40.61,14.73 40.61,14.61 39.7,13.7 39.7,7.25 v42.44,4.52 | v35.96,13.56 35.94,13.59 35.1,13.59 35.03,13.65 35.03,14.71 33.27,16.48 31.94,16.48 31.08,17.34 v30.04,17.34
TX/IO8  (via drill 0.39)
  Top 0.178: X3.28 37.77,4.86 v38.08,4.55
  Bottom 0.178: JP1.2 41.21,1.27 38.08,4.4 v38.08,4.55
TXD0  (via drill 0.39)
  Top 0.178: IC3.20 21.26,11.21 21.48,11.43 22.16,11.43 v22.42,11.68 | v37.82,2.8 38.19,3.17 38.66,3.17 40.17,4.68 X3.31
  Bottom 0.178: v22.42,11.68 22.29,11.56 22.29,10.16 24.07,8.38 24.07,5.65 26.98,2.74 34.89,2.74 35.97,3.82 36.94,3.82 37.82,2.93 v37.82,2.8
V_NEOI2C  (via drill 0.39)
  Top 0.305: C7.1 32.32,10.86 U1.5 31.3,11.08 v31.3,11.75 | LED1.2 32.6,7.37 v31.18,7.37 | CONN1.2 30.76,15.25 30.58,15.07 v30.07,15.07
  Bottom 0.305: v31.18,7.37 31.11,7.43 31.11,11.56 v31.3,11.75 31.05,12 31.05,12.37 30.13,13.29 30.13,15.01 v30.07,15.07
VBAT  (via drill 0.39)
  Top 0.178: R1.2 24.13,13.34 23.18,14.29
  Top 0.254: v17.08,14.1 17.27,14.29 23.18,14.29
  Top 0.305: Q3.3 v11.75,12.45 11.75,15.37 X1.2 14.77,18.39 C3.1 16.12,21.2 JP3.1 | v17.08,14.1 17.08,13.78 16.45,13.14 15.85,13.14 U3.3
  Bottom 0.305: v17.08,14.1 15.43,12.45 v11.75,12.45
VBUS  (via drill 0.39)
  Top 0.305: X6.A4B9 5.62,13.83 5.1,13.31 | 5.1,13.31 3.98,12.19 3.87,12.19 3.87,9.27 | 3.87,9.27 3.87,8.89 | 3.87,8.89 | 3.87,9.27 | 3.87,9.27 5.44,9.27 5.68,9.03 X6.B4A9 6.84,9.03 7.81,8.06 10.21,8.06 | 10.21,8.06 Q3.1 10.8,11.8 D4.A | CHG.A 2.04,6.22 2.79,6.22 3.87,7.3 3.87,8.89 | 18.61,12.13 18.61,12.86 U3.4 | R12.2 18.25,12.13 18.61,12.13 | 18.61,12.13 v19.11,12.13 | 10.21,8.06 10.86,8.06 v11.49,7.43 | v3.62,15.88 3.62,14.8 5.1,13.31 | IC3.7 18.83,6.33 18.83,6.22 18.51,6.22 | 18.51,6.22 R9.8 R9.7 | 18.51,6.22 17.61,6.22 C11.1 17.72,6.33 v17.72,6.92
  Bottom 0.305: v19.11,12.13 19.18,12.06 19.18,8.26 17.84,6.92 v17.72,6.92 17.72,6.1 17.34,5.71 13.21,5.71 v11.49,7.43 | JP3.3 21.08,21.59 19.88,20.38 7.24,20.38 3.62,16.76 v3.62,15.88
VBUS_DET
  Top 0.178: IC3.8 19.82,6.7 19.82,6.27 20.21,5.89 R9.6
  Top 0.203: R9.1 R9.2 19.41,4.24 20.21,5.04 R9.6
VHI  (via drill 0.39)
  Top 0.305: Q3.2 12.7,10.73 14.1,12.13 D4.C 13.22,13.08 13.22,16.07 14.61,17.46 20.22,17.46 20.92,16.77 U2.1 23.33,16.77 R7.2 | C6.1 22.27,16.38 22.76,16.87 R7.2 | v28.45,11.77 28.48,11.74 U1.1 | v24.32,15.87 23.43,16.76 R7.2
  Bottom 0.305: v28.45,11.77 27.5,10.82 26.48,10.82 24.13,13.17 24.13,15.68 v24.32,15.87

### Text on the board
tPlace: BAT | EN | USB | 13 | 12 | 27 | 33 | 15 | 32 | 14 | SCL | SDA | adafruit! | #13 | QT I2C | CHG | reset | SW38 | Feather ESP32 v2 | RST | 3V | NC | GND | A0 | A1 | A2 | A3 | A4 | A5 | SCK | MO | MI | RX | TX | 37
bPlace: 3.7/4.2V / LiPoly Batt / µUSB charge | BAT | En | USB | 33/A9 | 15/A8 | 32/A7 | 14/A6 | 13/A12 | 12/A11 | 27/A10 | SCL/20 | SDA/22 | ESP32 8MB Flash & 2MB PSRAM / WiFi + BT | V2 | RST | 3V | NC | GND | A0 / DAC2 | A1 / DAC1 | A2/34 | A3/39 | A4/36 | A5/4 | SCK/5 | MOSI/19 | MISO/21 | RX/7 | TX/8 | I37